# Altium schematic sheet SC10033E1_2.SchDoc: Meter_1
size A3
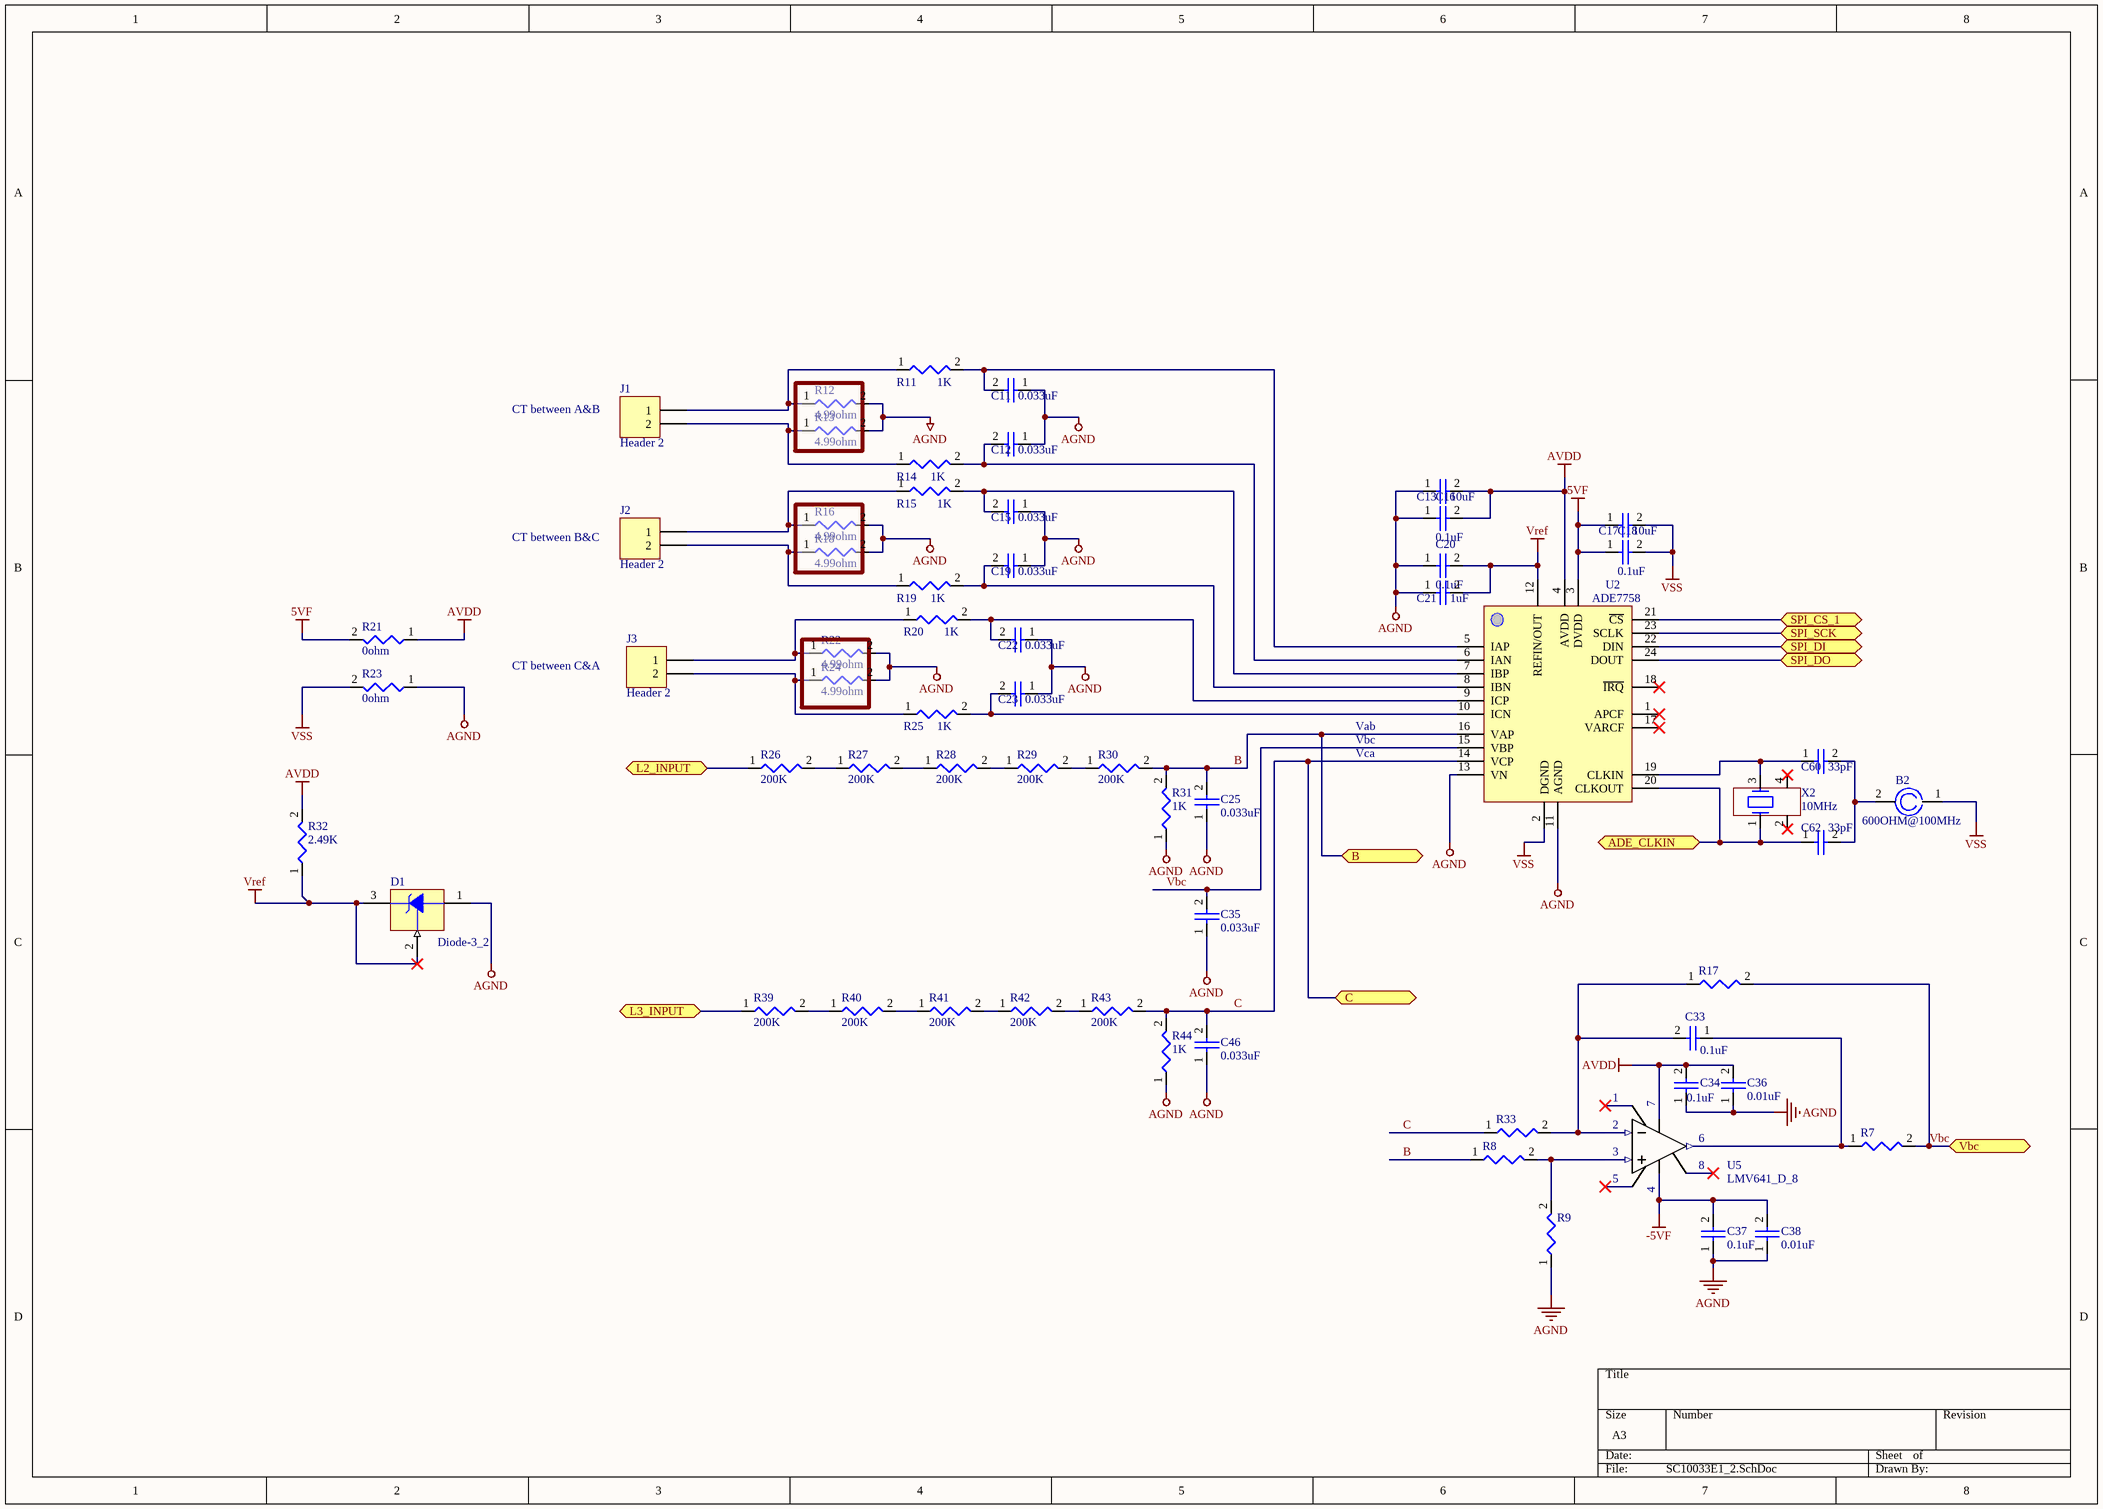
[diagram p0: SC10033E1_2.SchDoc]

## Parts
B2  value 600OHM@100MHz  [L0805]  (hidden comment: FERRITE)
C11  value 0.033uF  [C0805]  (hidden comment: CAP)
C12  value 0.033uF  [C0805]  (hidden comment: CAP)
C13  10uF  [C0805]
C15  value 0.033uF  [C0805]  (hidden comment: CAP)
C16  value 0.1uF  [C0805]  (hidden comment: CAP)
C17  10uF  [C0805]
C18  value 0.1uF  [C0805]  (hidden comment: CAP)
C19  value 0.033uF  [C0805]  (hidden comment: CAP)
C20  value 0.1uF  [C0805]  (hidden comment: CAP)
C21  value 1uF  [C0805]  (hidden comment: CAP)
C22  value 0.033uF  [C0805]  (hidden comment: CAP)
C23  value 0.033uF  [C0805]  (hidden comment: CAP)
C25  value 0.033uF  [C0805]  (hidden comment: CAP)
C33  value 0.1uF  [C0805]  (hidden comment: CAP)  (no BOM)
C34  value 0.1uF  [C0805]  (hidden comment: CAP)
C35  value 0.033uF  [C0805]  (hidden comment: CAP)
C36  value 0.01uF  [C0805]  (hidden comment: CAP)
C37  value 0.1uF  [C0805]  (hidden comment: CAP)
C38  value 0.01uF  [C0805]  (hidden comment: CAP)
C46  value 0.033uF  [C0805]  (hidden comment: CAP)
C60  value 33pF  [C0805]  (hidden comment: CAP)
C62  value 33pF  [C0805]  (hidden comment: CAP)
D1  Diode-3_2  [SOT23-321]
J1  Header 2  [533980271_sd]
J2  Header 2  [533980271_sd]
J3  Header 2  [533980271_sd]
R7  RES  [R0805]  (value not drawn)
R8  RES  [R0603]  (value not drawn)
R9  RES  [R0603]  (value not drawn)
R11  value 1K  [R0805]  (hidden comment: RES)
R12  value 4.99ohm  [R0805]  (hidden comment: RES)
R13  value 4.99ohm  [R0805]  (hidden comment: RES)
R14  value 1K  [R0805]  (hidden comment: RES)
R15  value 1K  [R0805]  (hidden comment: RES)
R16  value 4.99ohm  [R0805]  (hidden comment: RES)
R17  RES  [R0603]  (value not drawn)
R18  value 4.99ohm  [R0805]  (hidden comment: RES)
R19  value 1K  [R0805]  (hidden comment: RES)
R20  value 1K  [R0805]  (hidden comment: RES)
R21  value 0ohm  [R0805]  (hidden comment: RES)
R22  value 4.99ohm  [R0805]  (hidden comment: RES)
R23  value 0ohm  [R0805]  (hidden comment: RES)
R24  value 4.99ohm  [R0805]  (hidden comment: RES)
R25  value 1K  [R0805]  (hidden comment: RES)
R26  value 200K  [R0805]  (hidden comment: RES)
R27  value 200K  [R0805]  (hidden comment: RES)
R28  value 200K  [R0805]  (hidden comment: RES)
R29  value 200K  [R0805]  (hidden comment: RES)
R30  value 200K  [R0805]  (hidden comment: RES)
R31  value 1K  [R0805]  (hidden comment: RES)
R32  value 2.49K  [R0805]  (hidden comment: RES)
R33  RES  [R0603]  (value not drawn)
R39  value 200K  [R0805]  (hidden comment: RES)
R40  value 200K  [R0805]  (hidden comment: RES)
R41  value 200K  [R0805]  (hidden comment: RES)
R42  value 200K  [R0805]  (hidden comment: RES)
R43  value 200K  [R0805]  (hidden comment: RES)
R44  value 1K  [R0805]  (hidden comment: RES)
U2  ADE7758  [SOIC24-W]
U5  LMV641_D_8  [M08A]
X2  value 10MHz  [XTAL_5X3_2]  (hidden comment: ABM3C)

## Ports
ADE_CLKIN (bidir), B, C, L2_INPUT, L3_INPUT, SPI_CS_1, SPI_DI, SPI_DO (bidir), SPI_SCK, Vbc

## Nets
5VF: C17.1 C18.1 R21.2 U2.3(DVDD)
-5VF: C37.2 C38.2 U5.4(V-)
AGND: C11.1 C12.1 C13.1 C15.1 C16.1 C19.1 C20.1 C21.1 C22.1 C23.1 C25.1 C34.1 C35.1 C36.1 C37.1 C38.1 C46.1 D1.1(A) R9.1 R12.2 R13.2 R16.2 R18.2 R22.2 R23.1 R24.2 R31.1 R44.1 U2.11(AGND) U2.13(VN)
AVDD: C13.2 C16.2 C34.2 C36.2 R21.1 R32.2 U2.4(AVDD) U5.7(V+)
Vref: C20.2 C21.2 D1.2(R) D1.3(C) R32.1 U2.12(REFIN/OUT)
VSS: B2.1 C17.2 C18.2 R23.2 U2.2(DGND)
ADE_CLKIN: C62.1 U2.20(CLKOUT) X2.1 ; port ADE_CLKIN
B: C25.2 R8.1 R30.2 R31.2 U2.16(VAP) ; port B
C: C46.2 R33.1 R43.2 R44.2 U2.14(VCP) ; port C
L2_INPUT: R26.1 ; port L2_INPUT
L3_INPUT: R39.1 ; port L3_INPUT
SPI_CS_1: U2.21(~{CS}) ; port SPI_CS_1
SPI_DI: U2.22(DIN) ; port SPI_DI
SPI_DO: U2.24(DOUT) ; port SPI_DO
SPI_SCK: U2.23(SCLK) ; port SPI_SCK
Vbc: C35.2 R7.2 R17.2 U2.15(VBP) ; port Vbc
NetB2_2: B2.2 C60.2 C62.2
NetC11_2: C11.2 R11.2 U2.5(IAP)
NetC12_2: C12.2 R14.2 U2.6(IAN)
NetC15_2: C15.2 R15.2 U2.7(IBP)
NetC19_2: C19.2 R19.2 U2.8(IBN)
NetC22_2: C22.2 R20.2 U2.9(ICP)
NetC23_2: C23.2 R25.2 U2.10(ICN)
NetC33_1: C33.1 R7.1 U5.6(OUT)
NetC33_2: C33.2 R17.1 R33.2 U5.2(IN-)
NetC60_1: C60.1 U2.19(CLKIN) X2.3
NetJ1_1: J1.1 R11.1 R12.1
NetJ1_2: J1.2 R13.1 R14.1
NetJ2_1: J2.1 R15.1 R16.1
NetJ2_2: J2.2 R18.1 R19.1
NetJ3_1: J3.1 R20.1 R22.1
NetJ3_2: J3.2 R24.1 R25.1
NetR8_2: R8.2 R9.2 U5.3(IN+)
NetR26_2: R26.2 R27.1
NetR27_2: R27.2 R28.1
NetR28_2: R28.2 R29.1
NetR29_2: R29.2 R30.1
NetR39_2: R39.2 R40.1
NetR40_2: R40.2 R41.1
NetR41_2: R41.2 R42.1
NetR42_2: R42.2 R43.1

Not connected (* = marked no-connect by the designer): U2 1(APCF)* 17(VARCF)* 18(~{IRQ})*; U5 1(NC)* 5(NC_3)* 8(NC_2)*; X2 2* 4*

## Notes on the sheet
- CT between A&B
- CT between B&C
- CT between C&A
- Vab
- Vbc
- Vca

## Library data of the parts
B2 = EL00002: Ferrite Bead 600OHM@100MHz 200mA SMD 0805 ROHS; Manufacturer: Wuerth Electronic; Manufacturer P/N: 742792041; ID: 2; HelpURL: \\192.168.1.3\Esh\Department\RD\CAD\Component\Ferrite Bead\WE_742792041.pdf; P/N: EL00002; Type: ****
C11 C12 C15 C19 C22 C23 C25 C35 C46 = EC00079: CAP SMD X7R 50V 10% 0.033uF 0805 ROHS; Manufacturer: Murata; Manufacturer P/N: GRM219R71H333KA01; ID: 79; HelpURL: \\192.168.1.3\Esh\Department\RD\CAD\Component\Capacitor\smd\Murata_mpdf.pdf; P/N: EC00079
C13 C17 = EC00034: CAP SMD CR X5R 16V 10% 10uF 0805 ROHS; Manufacturer: Murata; Manufacturer P/N: GRM21BR61C106KE15; Value: 10uF_16V; ID: 34; Type: ****; HelpURL: *; P/N: EC00034
C16 C18 C20 = EC00014: CAP SMD CR X7R 50V 10% 0.1uF 0805 ROHS; Manufacturer: YAGEO; Manufacturer P/N: CC0805KRX7R9BB104; ID: 14; HelpURL: *; P/N: EC00014
C21 = EC00002: CAP SMD CR X7R 50V 10% 1uF 0805 ROHS; Manufacturer: YAGEO; Manufacturer P/N: CC0805KKX7R9BB105; ID: 2; HelpURL: *; P/N: EC00002
C33 C34 C37 = EC00078: CAP SMD CR X7R 50V 10% 0.1uF 0805 ROHS; Manufacturer: Murata; Manufacturer P/N: GRM21BR71H104KA01; ID: 78; Type: ****; HelpURL: \\192.168.1.3\Esh\Department\RD\CAD\Component\Capacitor\smd\Murata_GRM21BR71H104KA01#.pdf; P/N: EC00078
C36 C38 = EC00018: CAP SMD CR X7R 50V 10% 10nF 0805 ROHS; Manufacturer: Murata; Manufacturer P/N: GRM216R71H103KA01D; ID: 18; HelpURL: *; P/N: EC00018
C60 C62 = EC00017: CAP SMD C0G 50V 5% 33pF 0805 ROHS; Manufacturer: YAGEO; Manufacturer P/N: CC0805JRNPO9BN330; ID: 17; HelpURL: \\192.168.1.3\Esh\Department\RD\CAD\Component\Capacitor\smd\Murata_GQM2195C1H330JB01D.pdf; P/N: EC00017
D1 = EU00043: IC PROGRAMMABLE PRECISION REFERENCES,2.5-20V,0.5%,SMD,ROHS; Manufacturer: DIODES; Manufacturer P/N: ZTL431BFTA; ID: 43; Value: ZTL431BFTA; Type: *****; HelpURL: \\192.168.1.3\Esh\Department\RD\CAD\Component\TL431\ZTL431_432.pdf; P/N: EU00043
J1-J3 = EJ00039: CONNECTOR 1.25mm Pitch Header, Surface Mount, Vertical, Lead-Free, 2 Circuits; Manufacturer: MOLEX; ID: 39; Value: 533980271; HelpURL: \\192.168.1.3\Esh\Department\RD\CAD\Component\connector\molex\533980271_sd.pdf; P/N: EJ00039; Manufacturer P/N: 533980271
R7 = ER00026: RES THICK_FILM SMD 0 OHM 5% 1/8W ROHS 0805; Manufacturer: YAGEO; Manufacturer P/N: RC0805JR-070RL; Value: 0ohm; ID: 26; HelpURL: *; P/N: ER00026
R8 R9 R17 R33 = ER00211: RES THIN_FILM SMD 10K 0.1% 1/10W ±25ppm/℃ ROHS 0603; Manufacturer: YAGEO; Manufacturer P/N: RT0603BRD0710KL; ID: 211; HelpURL: \\192.168.1.3\Esh\Department\RD\CAD\Component\Resistor\SMD\YAGEO_PYu-RT_1-to-0.05_RoHS_L_4.pdf; Value: 10K; P/N: ER00211
R11 R14 R15 R19 R20 R25 = ER00028: RES THICK_FILM SMD 1K 1% 1/8W ROHS 0805; Manufacturer: YAGEO; Manufacturer P/N: RC0805FR-071KL; ID: 28; HelpURL: *; P/N: ER00028
R12 R13 R16 R18 R22 R24 = ER00201: RES THIN_FILM SMD 4.99 ohm 0.1% 1/8W ±25ppm/℃ ROHS 0805; Manufacturer: YAGEO; Manufacturer P/N: RT0805BRD074R99L; ID: 201; HelpURL: *; P/N: ER00201
R21 R23 = ER00026: RES THICK_FILM SMD 0 OHM 5% 1/8W ROHS 0805; Manufacturer: YAGEO; Manufacturer P/N: RC0805JR-070RL; ID: 26; HelpURL: *; P/N: ER00026
R26-R30 R39-R43 = ER00036: RES THIN_FILM SMD 200K 0.1% 1/8W 25PPM ROHS 0805; Manufacturer: YAGEO; Manufacturer P/N: RT0805BRD07200KL; ID: 36; HelpURL: *; P/N: ER00036
R31 R44 = ER00110: RES THIN_FILM 1K 0.1% 1/8W ±25ppm/℃ ROHS SMD 0805; Manufacturer: YAGEO; Manufacturer P/N: RT0805BRD071KL; ID: 110; HelpURL: \\192.168.1.3\Esh\Department\RD\CAD\Component\Resistor\SMD\YAGEO_PYu-RT_1-to-0.05_RoHS_L_4.pdf; P/N: ER00110
R32 = ER00108: RES THICK_FILM 2.49K 1% 1/8W ROHS SMD 0805; Manufacturer: YAGEO; Manufacturer P/N: RC0805FR-072K49L; ID: 108; HelpURL: *; P/N: ER00108
U2 = EU00042: IC Energy Measurement,Irms,VA,VAR,Vrms,Watt,Output:Pulsed&SPI,SOIC_W-24,ROHS; Manufacturer P/N: ADE7758ARWZRL; Manufacturer: ANALOG DEVICES; ID: 42; Value: ADE7758ARWZRL; HelpURL: \\192.168.1.3\Esh\Department\RD\CAD\Component\Energy Measurement\ADE7758.pdf; P/N: EU00042; Type: *****
U5 = EU00065: Op Amp,10MHz,12V,Low Power,SOIC-8,RoHS; Manufacturer P/N: LMV641MAE/NOPB; Manufacturer: TI; ID: 65; Value: LMV641MAE/NOPB; HelpURL: \\192.168.1.3\Esh\Department\RD\CAD\Component\OP\lmv641.pdf; P/N: EU00065; Type: *****
X2 = EX00008: XTAL 10MHz 18PF +/-30PPM,3.2mmWx5mmLx1.3mmH,-40~85,RoHS,SMD; Manufacturer: ABRACON; Manufacturer P/N: ABM3C-10.000MHZ-D4Y-T; ID: 8; HelpURL: \\192.168.1.3\Esh\Department\RD\CAD\Component\Crystal\abracon_abm3c.pdf; P/N: EX00008; Type: *****